# EAGLE design freeDSP (EAGLE 7.2.0)
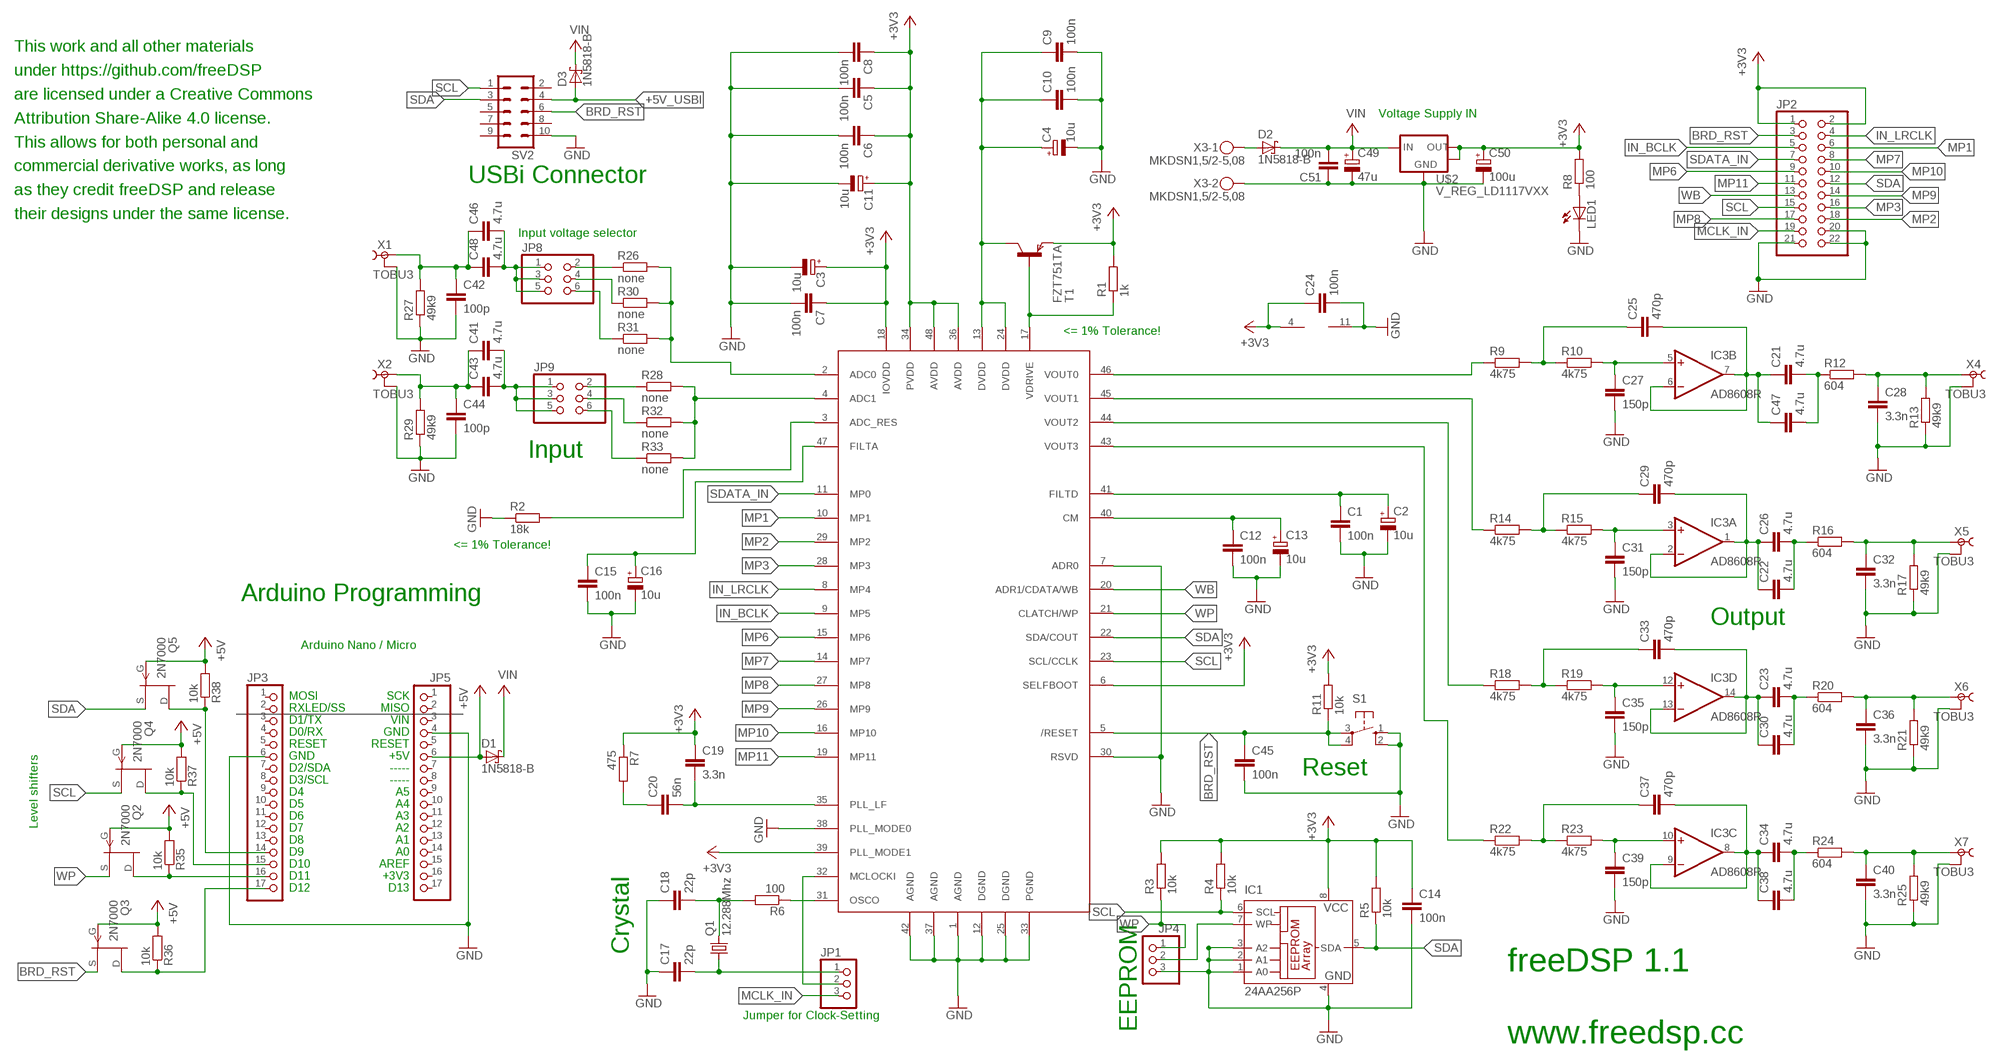
[diagram p0: schematic, sheet 1]

## Parts
C1  100n  C-EU025-025X050  [C025-025X050]
C2  10u  CPOL-EUE1.8-4  [E1,8-4]
C3  10u  CPOL-EUE1.8-4  [E1,8-4]
C4  10u  CPOL-EUE1.8-4  [E1,8-4]
C5  100n  C-EU025-025X050  [C025-025X050]
C6  100n  C-EU025-025X050  [C025-025X050]
C7  100n  C-EU025-025X050  [C025-025X050]
C8  100n  C-EU025-025X050  [C025-025X050]
C9  100n  C-EU025-025X050  [C025-025X050]
C10  100n  C-EU025-025X050  [C025-025X050]
C11  10u  CPOL-EUE1.8-4  [E1,8-4]
C12  100n  C-EU025-025X050  [C025-025X050]
C13  10u  CPOL-EUE1.8-4  [E1,8-4]
C14  100n  C-EU025-025X050  [C025-025X050]
C15  100n  C-EU025-025X050  [C025-025X050]
C16  10u  CPOL-EUE1.8-4  [E1,8-4]
C17  22p  C-EU025-025X050  [C025-025X050]
C18  22p  C-EU025-025X050  [C025-025X050]
C19  3.3n  C-EU025-025X050  [C025-025X050]
C20  56n  C-EU025-025X050  [C025-025X050]
C21  4.7u  C-EU050-075X075  [C050-075X075]
C22  4.7u  C-EU050-075X075  [C050-075X075]
C23  4.7u  C-EU050-075X075  [C050-075X075]
C24  100n  C-EU025-025X050  [C025-025X050]
C25  470p  C-EU050-050X075  [C050-050X075]
C26  4.7u  C-EU050-075X075  [C050-075X075]
C27  150p  C-EU025-025X050  [C025-025X050]
C28  3.3n  C-EU025-025X050  [C025-025X050]
C29  470p  C-EU050-050X075  [C050-050X075]
C30  4.7u  C-EU050-075X075  [C050-075X075]
C31  150p  C-EU025-025X050  [C025-025X050]
C32  3.3n  C-EU025-025X050  [C025-025X050]
C33  470p  C-EU050-050X075  [C050-050X075]
C34  4.7u  C-EU050-075X075  [C050-075X075]
C35  150p  C-EU025-025X050  [C025-025X050]
C36  3.3n  C-EU025-025X050  [C025-025X050]
C37  470p  C-EU050-050X075  [C050-050X075]
C38  4.7u  C-EU050-075X075  [C050-075X075]
C39  150p  C-EU025-025X050  [C025-025X050]
C40  3.3n  C-EU025-025X050  [C025-025X050]
C41  4.7u  C-EU050-075X075  [C050-075X075]
C42  100p  C-EU025-025X050  [C025-025X050]
C43  4.7u  C-EU050-075X075  [C050-075X075]
C44  100p  C-EU025-025X050  [C025-025X050]
C45  100n  C-EU025-025X050  [C025-025X050]
C46  4.7u  C-EU050-075X075  [C050-075X075]
C47  4.7u  C-EU050-075X075  [C050-075X075]
C48  4.7u  C-EU050-075X075  [C050-075X075]
C49  47u  CPOL-EUE2.5-6  [E2,5-6]
C50  100u  CPOL-EUE2.5-6  [E2,5-6]
C51  100n  C-EU025-025X050  [C025-025X050]
D1  1N5818-B  [DO41-7.6]
D2  1N5818-B  [DO41-7.6]
D3  1N5818-B  [DO41-7.6]
IC1  24AA256P  [DIL8]
IC3  AD8608R  [SO-14]
JP1  PINHD-1X3  [1X03]
JP2  PINHD-2X11  [2X11]
JP3  PINHD-1X17  [1X17]
JP4  PINHD-1X3  [1X03]
JP5  PINHD-1X17  [1X17]
JP8  PINHD-2X3  [2X03]
JP9  PINHD-2X3  [2X03]
LED1  LED3MM  [LED3MM]
Q1  12.288Mhz  CRYSTALHC49S  [HC49/S]
Q2  2N7000  2N3819  [TO92]
Q3  2N7000  2N3819  [TO92]
Q4  2N7000  2N3819  [TO92]
Q5  2N7000  2N3819  [TO92]
R1  1k  R-EU_0207/10  [0207/10]
R2  18k  R-EU_0207/10  [0207/10]
R3  10k  R-EU_0207/10  [0207/10]
R4  10k  R-EU_0207/10  [0207/10]
R5  10k  R-EU_0207/10  [0207/10]
R6  100  R-EU_0207/10  [0207/10]
R7  475  R-EU_0207/10  [0207/10]
R8  100  R-EU_0207/10  [0207/10]
R9  4k75  R-EU_0207/10  [0207/10]
R10  4k75  R-EU_0207/10  [0207/10]
R11  10k  R-EU_0207/10  [0207/10]
R12  604  R-EU_0207/10  [0207/10]
R13  49k9  R-EU_0207/10  [0207/10]
R14  4k75  R-EU_0207/10  [0207/10]
R15  4k75  R-EU_0207/10  [0207/10]
R16  604  R-EU_0207/10  [0207/10]
R17  49k9  R-EU_0207/10  [0207/10]
R18  4k75  R-EU_0207/10  [0207/10]
R19  4k75  R-EU_0207/10  [0207/10]
R20  604  R-EU_0207/10  [0207/10]
R21  49k9  R-EU_0207/10  [0207/10]
R22  4k75  R-EU_0207/10  [0207/10]
R23  4k75  R-EU_0207/10  [0207/10]
R24  604  R-EU_0207/10  [0207/10]
R25  49k9  R-EU_0207/10  [0207/10]
R26  none  R-EU_0207/10  [0207/10]
R27  49k9  R-EU_0207/10  [0207/10]
R28  none  R-EU_0207/10  [0207/10]
R29  49k9  R-EU_0207/10  [0207/10]
R30  none  R-EU_0207/10  [0207/10]
R31  none  R-EU_0207/10  [0207/10]
R32  none  R-EU_0207/10  [0207/10]
R33  none  R-EU_0207/10  [0207/10]
R35  10k  R-EU_0207/10  [0207/10]
R36  10k  R-EU_0207/10  [0207/10]
R37  10k  R-EU_0207/10  [0207/10]
R38  10k  R-EU_0207/10  [0207/10]
S1  10-XX  [B3F-10XX]
SV2  ML10  [ML10]
T1  FZT751TA  FZT789A  [SOT223]
U$1  ADAU1701  [LQFP-48]
U$2  V_REG_LD1117VXX  [78XXL]
X1  TOBU3  [TOBU3]
X2  TOBU3  [TOBU3]
X3  MKDSN1,5/2-5,08  [MKDSN1,5/2-5,08]
X4  TOBU3  [TOBU3]
X5  TOBU3  [TOBU3]
X6  TOBU3  [TOBU3]
X7  TOBU3  [TOBU3]

## Nets
1V8: C4.+ C9.1 C10.1 T1.2(C) T1.4(C) U$1.13(DVDD) U$1.24(DVDD)
+3V3: C3.+ C5.1 C6.1 C7.1 C8.1 C11.+ C14.1 C19.1 C24.1 C50.+ IC1.8(VCC) IC3.4(V+) JP2.1 JP2.2 R1.2 R3.2 R4.2 R5.2 R7.1 R8.2 R11.2 T1.3(E) U$1.6(SELFBOOT) U$1.18(IOVDD) U$1.34(PVDD) U$1.36(AVDD) U$1.39(PLL_MODE1) U$1.48(AVDD) U$2.GND(OUT) U$2.OUT2
+5V: D1.A JP5.6 Q2.2(G) Q3.2(G) Q4.2(G) Q5.2(G) R35.2 R36.2 R37.2 R38.2
+5V_USBI: D3.A SV2.4
ADC0: R28.2 R32.2 R33.2 U$1.4(ADC1)
BRD_RST: C45.1 JP2.3 Q3.3(S) R11.1 S1.3(P) S1.4(P1) SV2.6 U$1.5(/RESET)
CM: C12.1 C13.+ U$1.40(CM)
FILTA: C15.1 C16.+ U$1.47(FILTA)
FILTD: C1.1 C2.+ U$1.41(FILTD)
FILTOUT0: C28.1 R12.2 R13.2 X4.1
FILTOUT1: C32.1 R16.2 R17.2 X5.1
FILTOUT2: C36.1 R20.2 R21.2 X6.1
FILTOUT3: C40.1 R24.2 R25.2 X7.1
GND: C1.2 C2.- C3.- C4.- C5.2 C6.2 C7.2 C8.2 C9.2 C10.2 C11.- C12.2 C13.- C14.2 C15.2 C16.- C17.1 C18.1 C24.2 C27.2 C28.2 C31.2 C32.2 C35.2 C36.2 C39.2 C40.2 C42.2 C44.2 C45.2 C49.- C50.- C51.1 IC1.1(A0) IC1.2(A1) IC1.3(A2) IC1.4(GND) IC3.11(V-) JP2.20 JP2.21 JP2.22 JP3.6 JP4.3 JP5.4 LED1.K(C) R2.1 R13.1 R17.1 R21.1 R25.1 R27.1 R29.1 S1.1(S) S1.2(S1) SV2.10 U$1.1(AGND) U$1.7(ADR0) U$1.12(DGND) U$1.25(DGND) U$1.30(RSVD) U$1.33(PGND) U$1.37(AGND) U$1.38(PLL_MODE0) U$1.42(AGND) U$2.IN(GND) X1.2 X1.2@1 X1.2@2 X2.2 X2.2@1 X2.2@2 X3.2 X4.2 X4.2@1 X4.2@2 X5.2 X5.2@1 X5.2@2 X6.2 X6.2@1 X6.2@2 X7.2 X7.2@1 X7.2@2
IN_BCLK: JP2.5 U$1.9(MP5)
IN_LRCLK: JP2.4 U$1.8(MP4)
MCLK_IN: JP1.3 JP2.19
MP1: JP2.6 U$1.10(MP1)
MP2: JP2.18 U$1.29(MP2)
MP3: JP2.16 U$1.28(MP3)
MP6: JP2.9 U$1.15(MP6)
MP7: JP2.8 U$1.14(MP7)
MP8: JP2.17 U$1.27(MP8)
MP9: JP2.14 U$1.26(MP9)
MP10: JP2.10 U$1.16(MP10)
MP11: JP2.11 U$1.19(MP11)
N$1: R2.2 U$1.3(ADC_RES)
N$2: R1.1 T1.1(B) U$1.17(VDRIVE)
N$3: C19.2 C20.2 U$1.35(PLL_LF)
N$4: C23.1 C30.1 C33.2 IC3.13(D:-IN) IC3.14(D:OUT)
N$5: C20.1 R7.2
N$6: C18.2 Q1.2 R6.2
N$7: C17.2 JP1.1 Q1.1
N$8: R6.1 U$1.31(OSCO)
N$9: LED1.A R8.1
N$10: JP1.2 U$1.32(MCLOCKI)
N$11: JP3.15 Q4.1(D) R37.1
N$12: C21.2 C47.2 R12.1
N$13: C29.1 R14.2 R15.1
N$14: JP3.14 Q5.1(D) R38.1
N$15: C22.1 C26.1 C29.2 IC3.1(A:OUT) IC3.2(A:-IN)
N$16: C31.1 IC3.3(A:+IN) R15.2
N$17: C25.1 R9.2 R10.1
N$18: C21.1 C25.2 C47.1 IC3.6(B:-IN) IC3.7(B:OUT)
N$19: C22.2 C26.2 R16.1
N$20: C27.1 IC3.5(B:+IN) R10.2
N$21: C33.1 R18.2 R19.1
N$22: C23.2 C30.2 R20.1
N$23: JP3.16 Q2.1(D) R35.1
N$24: C35.1 IC3.12(D:+IN) R19.2
N$25: JP3.17 Q3.1(D) R36.1
N$26: C37.1 R22.2 R23.1
N$27: C34.1 C37.2 C38.1 IC3.8(C:OUT) IC3.9(C:-IN)
N$28: C39.1 IC3.10(C:+IN) R23.2
N$29: C34.2 C38.2 R24.1
N$30: C46.2 C48.2 JP8.1 JP8.3 JP8.5
N$31: C42.1 C46.1 C48.1 R27.2 X1.1
N$32: JP8.2 R26.1
N$33: JP8.4 R30.1
N$34: C41.1 C43.1 C44.1 R29.2 X2.1
N$35: JP8.6 R31.1
N$36: C41.2 C43.2 JP9.1 JP9.3 JP9.5
N$37: JP9.2 R28.1
N$38: JP9.4 R32.1
N$39: JP9.6 R33.1
N$40: R26.2 R30.2 R31.2 U$1.2(ADC0)
N$41: D2.A X3.1
N$43: IC1.7(WP) JP4.2
SCL: IC1.6(SCL) JP2.15 Q4.3(S) R4.1 SV2.1 U$1.23(SCL/CCLK)
SDA: IC1.5(SDA) JP2.12 Q5.3(S) R5.1 SV2.3 U$1.22(SDA/COUT)
SDATA_IN: JP2.7 U$1.11(MP0)
V+: C49.+ C51.2 D1.C D2.C D3.C U$2.OUT(IN) ; supply symbol labelled VIN
VOUT0: R9.1 U$1.46(VOUT0)
VOUT1: R14.1 U$1.45(VOUT1)
VOUT2: R18.1 U$1.44(VOUT2)
VOUT3: R22.1 U$1.43(VOUT3)
WB: JP2.13 U$1.20(ADR1/CDATA/WB)
WP: JP4.1 Q2.3(S) R3.1 U$1.21(CLATCH/WP)
Unconnected: JP3.1 JP3.2 JP3.3 JP3.4 JP3.5 JP3.7 JP3.8 JP3.9 JP3.10 JP3.11 JP3.12 JP3.13 JP5.1 JP5.2 JP5.3 JP5.5 JP5.7 JP5.8 JP5.9 JP5.10 JP5.11 JP5.12 JP5.13 JP5.14 JP5.15 JP5.16 JP5.17 SV2.2 SV2.5 SV2.7 SV2.8 SV2.9

## Notes on the sheet
- Voltage Supply IN
- USBi Connector
- This work and all other materials 
  under https://github.com/freeDSP 
  are licensed under a Creative Commons 
  Attribution Share-Alike 4.0 license. 
  This allows for both personal and 
  commercial derivative works, as long 
  as they credit freeDSP and release 
  their designs under the same license.
- Input voltage selector
- <= 1% Tolerance!
- Input
- <= 1% Tolerance!
- Arduino Programming
- Output
- Arduino Nano / Micro
- Reset
- Level shifters
- Crystal
- MOSI
  RXLED/SS
  D1/TX
  D0/RX
  RESET
  GND
  D2/SDA
  D3/SCL
  D4
  D5
  D6
  D7
  D8
  D9
  D10
  D11
  D12
- SCK
  MISO
  VIN
  GND
  RESET
  +5V
  -----
  -----
  A5
  A4
  A3
  A2
  A1
  A0
  AREF
  +3V3
  D13
- Jumper for Clock-Setting
- EEPROM
- freeDSP 1.1
  
  www.freedsp.cc

## Library data of the parts
C1 C5-C10 C12 C14 C15 C17-C48 C51 = rcl:C-EU: CAPACITOR, European symbol
C2-C4 C11 C13 C16 C49 C50 = rcl:CPOL-EU: POLARIZED CAPACITOR, European symbol
D1-D3 = diode:1N581*: 1.0A SCHOTTKY BARRIER RECTIFIER Source: http://www.diodes.com/datasheets/ds23001.pdf
IC1 = microchip:24*: Serial EEPROM I2C; MF: MICROCHIP; MPN: 24AA256-I/P; OC_FARNELL: 1331294; OC_NEWARK: 92C6872
IC3 = 0-ADI-variety:AD8608*
JP1 JP4 = pinhead:PINHD-1X3: PIN HEADER
JP2 = pinhead:PINHD-2X11: PIN HEADER
JP3 JP5 = pinhead:PINHD-1X17: PIN HEADER
JP8 JP9 = pinhead:PINHD-2X3: PIN HEADER
LED1 = led:LED: LED OSRAM: - CHIPLED LG R971, LG N971, LY N971, LG Q971, LY Q971, LO R971, LY R971 LH N974, LH R974 LS Q976, LO Q976, LY Q976 LO Q996 - Hyper CHIPLED LW Q18S LB Q993, LB Q99A, LB R99A - SideLED LS A670, LO A670, LY A670, LG A670, LP A670 LB A673, LV A673, LT A673, LW A673 LH A674 LY A675 LS A676, LA A676, LO A676, LY A676, LW A676 LS A679, LY A679, LG A679 - Hyper Micro SIDELED® LS Y876, LA Y876, LO Y876, LY Y876 LT Y87S - SmartLED LW L88C, LW L88S LB L89C, LB L89S, LG L890 LS L89K, LO L89K, LY L89K LS L896, LA L896, LO L896, LY L896 - TOPLED LS T670, LO T670, LY T670, LG T670, LP T670 LSG T670, LSP T670, LSY T670, LOP T670, LYG T670 LG T671, LOG T671, LSG T671 LB T673, LV T673, LT T673, LW T673 LH T674 LS T676, LA T676, LO T676, LY T676, LB T676, LH T676, LSB T676, LW T676 LB T67C, LV T67C, LT T67C, LS T67K, LO T67K, LY T67K, LW E67C LS E67B, LA E67B, LO E67B, LY E67B, LB E67C, LV E67C, LT E67C LW T67C LS T679, LY T679, LG T679 LS T770, LO T770, LY T770, LG T770, LP T770 LB T773, LV T773, LT T773, LW T773 LH T774 LS E675, LA E675, LY E675, LS T675 LS T776, LA T776, LO T776, LY T776, LB T776 LHGB T686 LT T68C, LB T68C - Hyper Mini TOPLED® LB M676 - Mini TOPLED Santana® LG M470 LS M47K, LO M47K, LY M47K Source: http://www.osram.convergy.de LUXEON: - LUMILED® LXK2-PW12-R00, LXK2-PW12-S00, LXK2-PW14-U00, LXK2-PW14-V00 LXK2-PM12-R00, LXK2-PM12-S00, LXK2-PM14-U00 LXK2-PE12-Q00, LXK2-PE12-R00, LXK2-PE12-S00, LXK2-PE14-T00, LXK2-PE14-U00 LXK2-PB12-K00, LXK2-PB12-L00, LXK2-PB12-M00, LXK2-PB14-N00, LXK2-PB14-P00, LXK2-PB14-Q00 LXK2-PR12-L00, LXK2-PR12-M00, LXK2-PR14-Q00, LXK2-PR14-R00 LXK2-PD12-Q00, LXK2-PD12-R00, LXK2-PD12-S00 LXK2-PH12-R00, LXK2-PH12-S00 LXK2-PL12-P00, LXK2-PL12-Q00, LXK2-PL12-R00 Source: www.luxeon.com KINGBRIGHT: KA-3528ASYC Source: www.kingbright.com
Q1 = crystal:CRYSTAL: CRYSTAL; OC_FARNELL: 1667008; OC_NEWARK: unknown
Q2-Q5 = transistor-fet:2N3819: N-Channel Junction FET
R1-R33 R35-R38 = rcl:R-EU_: RESISTOR, European symbol
S1 = switch-omron:10-XX: OMRON SWITCH; MPN: B3F-1000; OC_FARNELL: 176432; OC_NEWARK: 36M3542
SV2 = con-harting-ml:ML10: HARTING; OC_FARNELL: unknown; OC_NEWARK: unknown
T1 = zetex:FZT789A: PNP TRANSISTOR; MPN: FZT789A; OC_FARNELL: 9526633; OC_NEWARK: 97K0407
U$1 = analog-devices_2:ADAU1701
U$2 = SparkFun-PowerIC:V_REG_LD1117VXX: LD1117VXX voltage regulator. We carry the 3.3V version (COM-00526) in TO-220 package.
X1 X2 X4-X7 = con-hirschmann_verbessert:TOBU3: Female Cinch CONNECTOR ( RCA Jack ); MF: FARNELL; MPN: TOBU 3; OC_FARNELL: 592791; OC_NEWARK: 06WX5914
X3 = con-phoenix-508:MKDSN1,5/2-5,08: MKDSN 1,5/ 2-5,08 Printklemme Nennstrom: 13,5 A Nennspannung: 250 V Rastermaß: 5,08 mm Polzahl: 2 Anschlussart: Schraubanschluss Montage: Löten Anschlussrichtung Leiter/Platine: 0 ° Artikelnummer: 1729128 Source: http://eshop.phoenixcontact.com .. 1729128.pdf; MPN: MKDSN 1,5/2-5.08; OC_FARNELL: 1792903; OC_NEWARK: 30M2397

## Net classes
0 default: width 0.152 mm

## Board
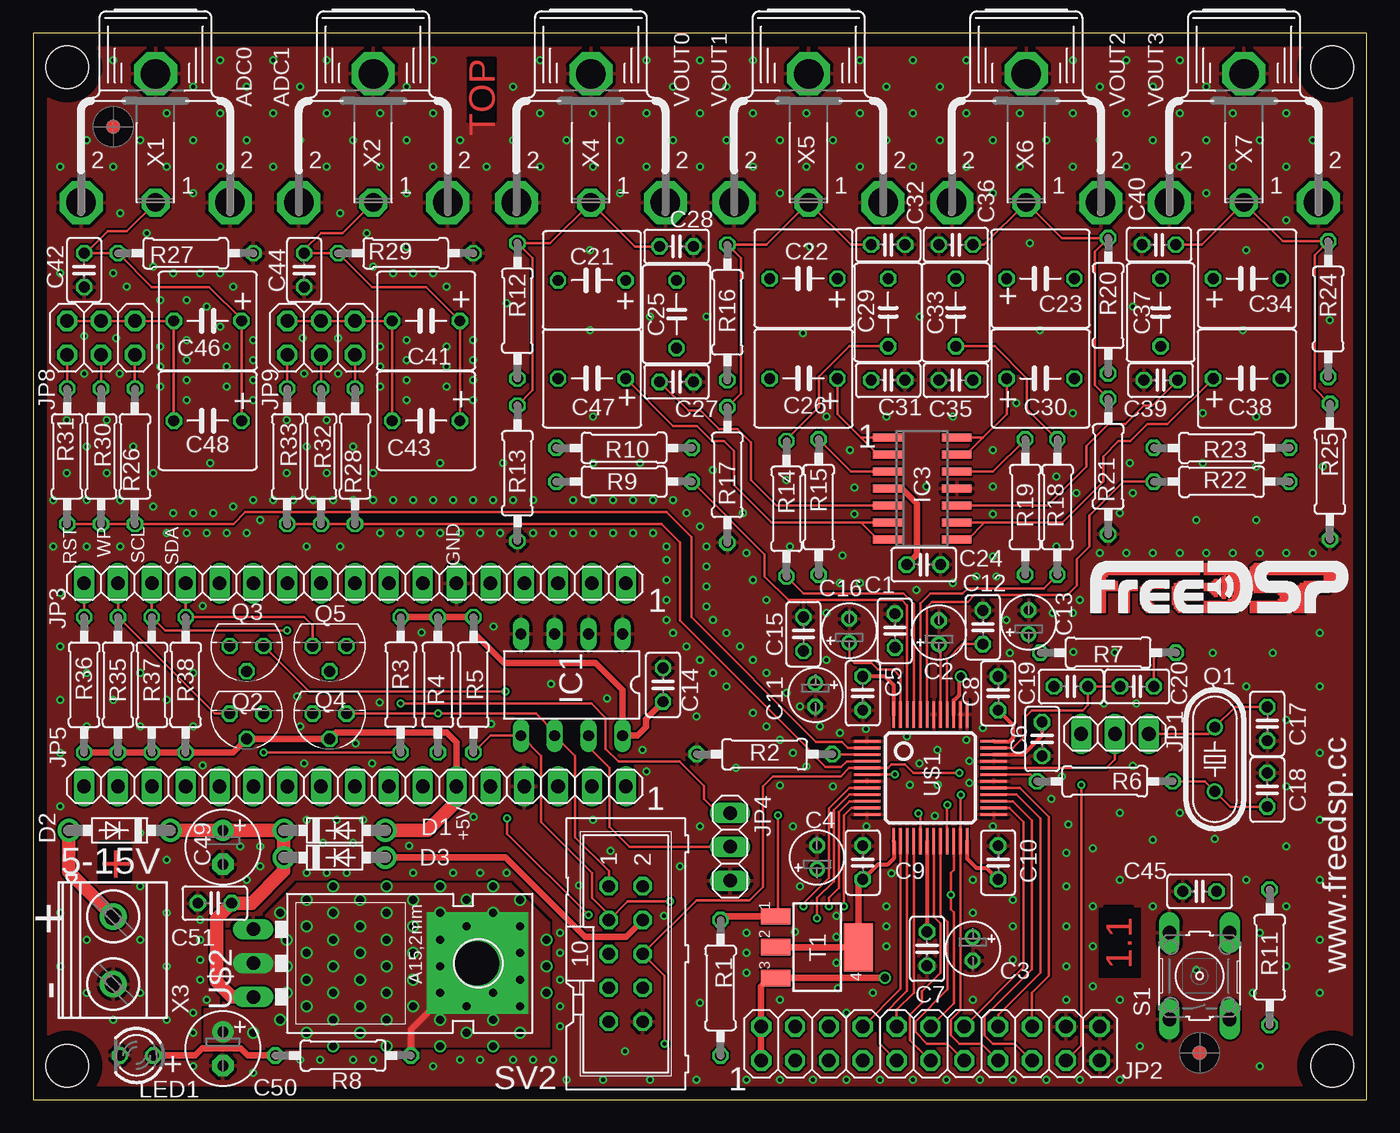
[diagram p1: board, top side]
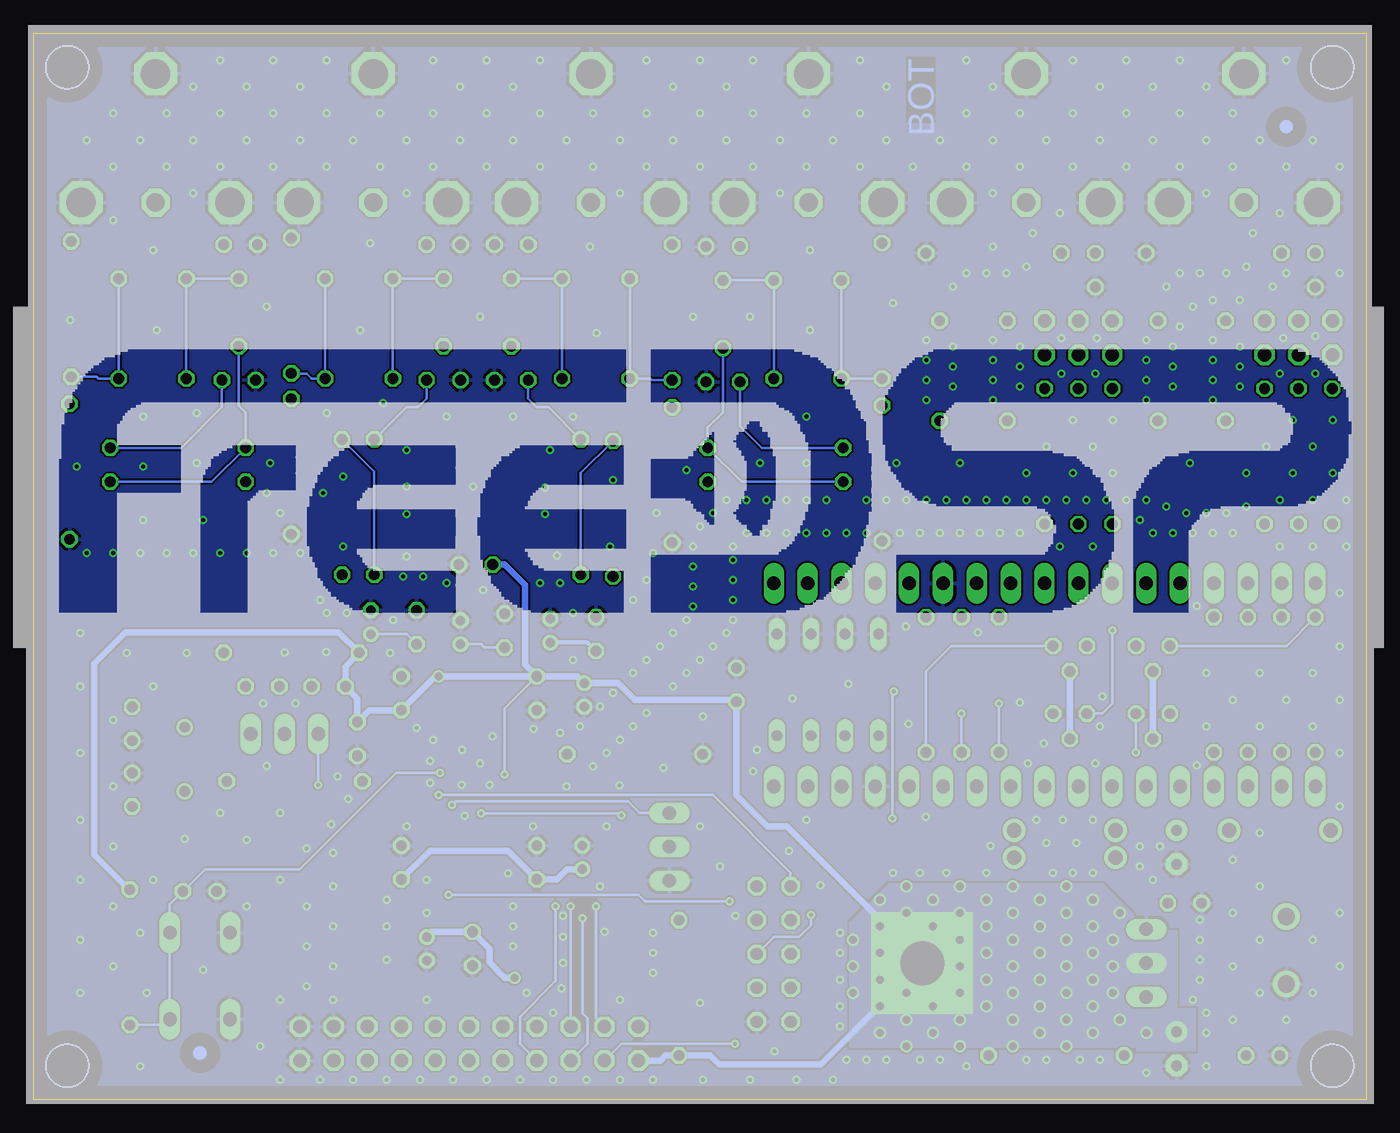
[diagram p2: board, bottom side, seen from below]

Size 100 x 80 mm. Coordinates in mm from the lower left corner, seen from the top.
Outline: 0,0 100,0 100,80 0,80 0,0
Copper layers (1*16): Top 0.035mm / dielectric 1.5mm / Bottom 0.035mm
Design rules "default *": minimum track width 0.15mm, minimum drill 0.3mm, track to track 0.15mm, track to pad 0.15mm, pad to pad 0.15mm, via to via 0.15mm, smd to smd 0mil, copper to edge 40mil, drill to drill 8mil, minimum pad ring 0.15mm, minimum via ring 0.15mm, stop-mask expansion 4mil, vias tented up to drill 0.3mm, thermal gap 10mil
Holes 3.2 mm at 97.46,77.46 2.54,77.46 97.46,2.54 2.54,2.54
tRestrict: area 80,9.2 to 83.1,14.4

### Footprints (pad centres in the part's own frame; a part is rotated, then mirrored left to right if it is on the bottom)
C025-025X050 = drill 0.813 octagon: 1 -1.27,0; 2 1.27,0
E1,8-4 = drill 0.711 pad 1.168: + -0.889,0 | drill 0.711 pad 1.168 octagon: - 0.889,0
C050-075X075 = drill 0.813 octagon: 1 -2.54,0; 2 2.54,0
C050-050X075 = drill 0.813 octagon: 1 -2.54,0; 2 2.54,0
E2,5-6 = drill 0.813 pad 1.6: + -1.27,0 | drill 0.813 pad 1.6 octagon: - 1.27,0
DO41-7.6 = drill 1.1 pad 1.7: A 3.81,0; C -3.81,0
DIL8 = drill 0.813 long: 1 -3.81,-3.81; 2 -1.27,-3.81; 3 1.27,-3.81; 4 3.81,-3.81; 5 3.81,3.81; 6 1.27,3.81; 7 -1.27,3.81; 8 -3.81,3.81
SO-14 = smd 0.6 x 2.2: 1 -3.81,-2.6; 2 -2.54,-2.6; 3 -1.27,-2.6; 4 0,-2.6; 5 1.27,-2.6; 6 2.54,-2.6; 7 3.81,-2.6; 8 3.81,2.6; 9 2.54,2.6; 10 1.27,2.6; 11 0,2.6; 12 -1.27,2.6; 13 -2.54,2.6; 14 -3.81,2.6
1X03 = drill 1.016 long: 1 -2.54,0; 2 0,0; 3 2.54,0
2X11 = drill 1.016 octagon: 1 -12.7,-1.27; 2 -12.7,1.27; 3 -10.16,-1.27; 4 -10.16,1.27; 5 -7.62,-1.27; 6 -7.62,1.27; 7 -5.08,-1.27; 8 -5.08,1.27; 9 -2.54,-1.27; 10 -2.54,1.27; 11 0,-1.27; 12 0,1.27; 13 2.54,-1.27; 14 2.54,1.27; 15 5.08,-1.27; 16 5.08,1.27; 17 7.62,-1.27; 18 7.62,1.27; 19 10.16,-1.27; 20 10.16,1.27; 21 12.7,-1.27; 22 12.7,1.27
1X17 = drill 1.016 long: 1 -20.32,0; 2 -17.78,0; 3 -15.24,0; 4 -12.7,0; 5 -10.16,0; 6 -7.62,0; 7 -5.08,0; 8 -2.54,0; 9 0,0; 10 2.54,0; 11 5.08,0; 12 7.62,0; 13 10.16,0; 14 12.7,0; 15 15.24,0; 16 17.78,0; 17 20.32,0
2X03 = drill 1.016 octagon: 1 -2.54,-1.27; 2 -2.54,1.27; 3 0,-1.27; 4 0,1.27; 5 2.54,-1.27; 6 2.54,1.27
LED3MM = drill 0.813 octagon: A -1.27,0; K 1.27,0
HC49/S = drill 0.813: 1 -2.413,0; 2 2.413,0
TO92 = drill 0.813 octagon: 1 1.27,0; 2 0,1.905; 3 -1.27,0
0207/10 = drill 0.813 octagon: 1 -5.08,0; 2 5.08,0
B3F-10XX = drill 1.016 long: 1 -3.251,2.261; 2 3.251,2.261; 3 -3.251,-2.261; 4 3.251,-2.261
ML10 = drill 0.914 octagon: 1 -5.08,-1.27; 2 -5.08,1.27; 3 -2.54,-1.27; 4 -2.54,1.27; 5 0,-1.27; 6 0,1.27; 7 2.54,-1.27; 8 2.54,1.27; 9 5.08,-1.27; 10 5.08,1.27
SOT223 = smd 1.219 x 2.235: 1 -2.311,-3.099; 2 0,-3.099; 3 2.311,-3.099 | smd 3.6 x 2.2: 4 0,3.099
LQFP-48 = smd 0.2 x 2: 1 -2.75,-4.75; 2 -2.25,-4.75; 3 -1.75,-4.75; 4 -1.25,-4.75; 5 -0.75,-4.75; 6 -0.25,-4.75; 7 0.25,-4.75; 8 0.75,-4.75; 9 1.25,-4.75; 10 1.75,-4.75; 11 2.25,-4.75; 12 2.75,-4.75; 25 2.75,4.75; 26 2.25,4.75; 27 1.75,4.75; 28 1.25,4.75; 29 0.75,4.75; 30 0.25,4.75; 31 -0.25,4.75; 32 -0.75,4.75; 33 -1.25,4.75; 34 -1.75,4.75; 35 -2.25,4.75; 36 -2.75,4.75 | smd 2 x 0.2: 13 4.75,-2.75; 14 4.75,-2.25; 15 4.75,-1.75; 16 4.75,-1.25; 17 4.75,-0.75; 18 4.75,-0.25; 19 4.75,0.25; 20 4.75,0.75; 21 4.75,1.25; 22 4.75,1.75; 23 4.75,2.25; 24 4.75,2.75; 37 -4.75,2.75; 38 -4.75,2.25; 39 -4.75,1.75; 40 -4.75,1.25; 41 -4.75,0.75; 42 -4.75,0.25; 43 -4.75,-0.25; 44 -4.75,-0.75; 45 -4.75,-1.25; 46 -4.75,-1.75; 47 -4.75,-2.25; 48 -4.75,-2.75
78XXL = drill 1.016 long: GND 0,-3.81; IN -2.54,-3.81; OUT 2.54,-3.81 | drill 3.302 pad 7.62 square: OUT2 0,13
TOBU3 = drill 1.397 octagon: 1 0,-2.54 | drill 2.21 octagon: 2 5.588,-2.54; 2@1 -5.588,-2.54; 2@2 0,7.11
MKDSN1,5/2-5,08 = drill 1.3 pad 2: 1 -2.561,0.025; 2 2.519,0.025

### Placement (x,y rotation side)
C1  64.64,35.18 90 top
C2  67.94,35.05 90 top
C3  70.48,11.3 270 top
C4  58.8,18.16 90 top
C5  62.23,30.48 270 top
C6  75.69,27.05 270 top
C7  67.06,11.3 270 top
C8  72.39,30.48 90 top
C9  62.23,17.78 90 top
C10  72.39,17.78 90 top
C11  58.67,30.35 270 top
C12  71.25,35.43 90 top
C13  74.68,35.81 90 top
C14  47.24,31.11 90 top
C15  57.78,34.92 90 top
C16  61.21,35.18 90 top
C17  92.58,28.19 90 top
C18  92.58,23.24 270 top
C19  77.85,30.99 0 top
C20  82.8,30.99 180 top
C21  41.91,61.47 180 top
C22  57.78,61.59 180 top
C23  75.56,61.59 0 top
C24  66.8,40.13 0 top
C25  48.26,58.93 90 top
C26  57.78,54.1 180 top
C27  48.26,53.85 0 top
C28  48.26,64.01 0 top
C29  64.14,59.05 90 top
C30  75.56,54.1 0 top
C31  64.14,53.98 0 top
C32  64.14,64.14 0 top
C33  69.22,59.05 90 top
C34  91.06,61.59 0 top
C35  69.22,53.98 180 top
C36  69.22,64.14 180 top
C37  84.58,59.05 90 top
C38  91.06,54.1 0 top
C39  84.58,53.98 180 top
C40  84.45,64.14 180 top
C41  29.46,58.42 180 top
C42  3.81,62.23 270 top
C43  29.46,50.93 180 top
C44  20.32,62.23 270 top
C45  87.5,15.62 180 top
C46  13.08,58.42 180 top
C47  41.91,54.1 180 top
C48  13.08,50.93 180 top
C49  14.22,18.92 270 top
C50  14.22,3.81 270 top
C51  13.62,14.74 0 top
D1  22.61,20.19 0 top
D2  6.48,20.19 180 top
D3  22.61,18.16 0 top
IC1  40.39,31.11 180 top
IC3  66.67,45.85 270 top
JP1  81.15,27.43 180 top
JP2  67.31,4.19 0 top
JP3  24.13,38.73 180 top
JP4  52.27,18.96 270 top
JP5  24.13,23.5 180 top
JP8  5.08,57.15 180 top
JP9  21.59,57.15 180 top
LED1  7.75,3.3 180 top
Q1  88.65,25.53 270 top
Q2  16,28.96 180 top
Q3  16,34.04 180 top
Q4  22.23,28.96 180 top
Q5  22.23,34.04 180 top
R1  51.56,8.38 270 top
R2  54.86,25.91 0 top
R3  27.56,31.11 90 top
R4  30.35,31.11 90 top
R5  33.02,31.11 90 top
R6  80.39,23.88 0 top
R7  80.64,33.53 0 top
R8  23.24,3.3 0 top
R9  44.32,46.35 180 top
R10  44.32,48.9 180 top
R11  92.76,10.67 90 top
R12  36.32,59.18 90 top
R13  36.32,46.99 90 top
R14  56.52,44.32 90 top
R15  58.93,44.45 90 top
R16  52.07,59.05 90 top
R17  52.07,46.86 90 top
R18  76.83,44.45 90 top
R19  74.42,44.45 90 top
R20  80.64,59.56 90 top
R21  80.64,47.5 90 top
R22  89.15,46.35 0 top
R23  89.15,48.9 0 top
R24  97.16,59.31 90 top
R25  97.28,47.12 90 top
R26  7.62,48.26 270 top
R27  11.43,63.5 180 top
R28  24.13,48.26 270 top
R29  27.94,63.5 180 top
R30  5.08,48.26 270 top
R31  2.54,48.26 270 top
R32  21.59,48.26 270 top
R33  19.05,48.26 270 top
R35  6.35,31.11 270 top
R36  3.81,31.11 270 top
R37  8.89,31.11 270 top
R38  11.43,31.11 270 top
S1  87.5,9.27 90 top
SV2  44.45,10.92 270 top
T1  58.8,11.43 270 top
U$1  67.31,24.13 270 top
U$2  20.31,10.23 270 top
U$3  [VISION_REF10]  87.5,3.5 0 top
U$4  [VISION_REF10]  6,73 0 top
X1  9.17,69.85 0 top
X2  25.5,69.85 0 top
X3  5.97,11.18 270 top
X4  41.83,69.85 0 top
X5  58.17,69.85 0 top
X6  74.5,69.85 0 top
X7  90.83,69.85 0 top

### Tracks (layer width: path | path; a pad name or v marks a point on that pad's centre or on a via)
1V8
  Top 0.3: U$1.24 70.06,18.08 70.74,17.4 71.5,17.4 C10.1 | C9.1 63.37,17.65 64.14,17.65 64.56,18.08 U$1.13
  Top 0.5: C9.1 61.9,16.18 T1.4 T1.2
  Bottom 0.5: C10.1 70.23,18.67 64.39,18.67 C9.1 60.71,16.51 59.94,17.27 C4.+
+3V3  (via drill 0.3, 0.6)
  Top 0.2: U$1.6 v64.64,24.38
  Top 0.3: U$1.18 67.06,17.02 | 67.06,17.02 | U$1.34 74.27,25.88 75.69,27.3 C6.1 | U$1.39 69.06,29.94 69.47,30.35 69.47,31.62 v69.6,31.75 | U$1.36 73.23,26.88 73.53,27.18 73.53,28.07 C8.1 | U$1.48 64.56,31.07 63.88,31.75 C5.1 | 67.06,17.02 C7.1
  Top 0.5: R3.2 R4.2 R5.2 33.02,35.05 35.31,32.77 42.16,32.77 44.2,30.73 IC1.8 45.34,27.3 45.97,27.94 45.97,28.57 C14.1 | C24.1 66.29,40.89 66.29,44.7 65.15,45.85 IC3.4 | JP2.1 JP2.2 54.61,8.51 55.22,9.12 T1.3 63.86,9.12 v63.88,9.14 | R8.2 28.35,3.33 28.35,5.28 U$2.OUT2
  Bottom 0.2: v64.64,24.38 64.64,29.34 C5.1
  Bottom 0.5: C5.1 59.18,31.75 C11.+ 56.13,31.24 54.86,29.97 47.37,29.97 C14.1 47.24,22.81 44.91,20.48 43.44,20.48 33.31,10.35 U$2.OUT2 40.9,2.64 48.56,2.64 49.22,3.3 R1.2 52.58,3.3 52.96,2.92 JP2.1 | C5.1 63.12,32.64 63.12,38.61 64.64,40.13 C24.1 | C5.1 v69.6,31.75 69.85,31.75 C8.1 74.8,29.21 C6.1 75.69,30.1 C19.1 76.58,32.51 R7.1 77.09,35.05 93.09,35.05 95.42,32.72 95.42,18.35 92.82,15.75 R11.2 | C3.+ 70.1,12.57 C7.1 65.79,11.3 65.79,10.29 64.64,9.14 v63.88,9.14
  other vias: 20.5,15 20.5,13 20.5,11 20.5,9 20.5,7 20.5,5 22.5,14 22.5,12 22.5,10 22.5,8 22.5,6 24.5,5 26.5,6 24.5,7 24.5,9 24.5,11 24.5,13 24.5,15 26.5,14 26.5,12 26.5,10 26.5,8 28.5,15 28.5,13 28.5,11 28.5,9 28.5,7 30.5,14 30.5,12 30.5,10 30.5,6 32.5,15 32.5,13 32.5,7 32.5,5 34.5,6 34.5,14 30.5,8 34.5,8 36.5,13 36.5,11 36.5,9 36.5,7 36.5,5 38.5,8 38.5,10 38.5,12 36.5,15 18.5,14 18.5,6 19,12 19,10 19,8 16.5,5 22.5,16 26.5,16 30.5,16 34.5,16 30.5,4 34.5,4 26.5,4 22.5,4
  pour Top (no thermals): 16.27,12.66 14.26,12.66 14.26,6.78 12.86,6.78 12.86,3.59 17.33,3.59 17.33,3.98 38.7,3.98 38.7,13.3 35.81,16.19 19.81,16.19
  pour Bottom (no thermals): 16.27,12.62 14.26,12.62 14.26,6.75 12.86,6.75 12.86,3.71 17.18,3.71 17.18,3.95 38.7,3.95 38.7,13.26 35.81,16.16 19.81,16.16
+5V
  Top 0.5: JP5.6 31.75,26.8 30.99,27.56 22.73,27.56 Q4.2 Q2.2 14.99,26.04 R38.2 R37.2 R35.2 R36.2
  Top 1: JP5.6 31.75,22.35 29.59,20.19 D1.A
  Bottom 0.5: Q3.2 Q2.2 | Q4.2 Q5.2
+5V_USBI
  Top 0.5: SV2.4 44.45,12.19 41.4,12.19 35.43,18.16 D3.A
ADC0
  Top 0.2: R33.2 R32.2 R28.2 47.14,43.18 48.52,41.81 48.52,35.96 58.66,25.82 58.66,25.74 59.44,24.96 60.61,24.96 61.03,25.38 U$1.4
BRD_RST  (via drill 0.3)
  Top 0.2: v41.66,13.84 35.56,19.94 v35.56,21.08 | Q3.3 20.7,30.61 v35.43,30.61 | v69.47,24.51 66.04,24.51 65.41,25.15 64.39,25.15 64.12,24.88 U$1.5 61.2,24.88 60.58,24.26 55.5,24.26 54.74,23.5 54.74,15.95 53.73,14.94 49.74,14.94 SV2.6 47.37,9.27 v47.37,4.19
  Bottom 0.2: v41.66,13.84 41.66,13.08 42.55,12.19 44.45,12.19 SV2.6 | v35.43,30.61 35.56,30.48 v35.56,21.08 | v69.47,24.51 72.77,24.51 80.01,17.27 87.12,17.27 C45.1 89.76,14.63 S1.4 S1.3 90.19,5.59 R11.1 | JP2.3 55.88,4.19 v47.37,4.19
CM
  Top 0.2: U$1.40 68.56,33 69.72,34.16 C12.1
  Bottom 0.2: C12.1 72.01,34.92 C13.+
FILTA
  Top 0.2: U$1.47 65.06,31.71 64.52,32.26 63.37,32.26 62.87,32.77 61.59,32.77 61.21,33.15 C16.+
  Bottom 0.3: C15.1 58.42,34.29 C16.+
FILTD  (1 unrouted)
  Top 0.2: U$1.41 68.06,34.05 C2.+
  Bottom 0.2: C1.1 66.17,33.91 66.42,34.16 C2.+ | 68.06,34.05 68.06,34
FILTOUT0
  Top 0.2: C28.1 45.13,64.01 X4.1 38.78,64.26 R12.2 37.47,63.12 37.47,53.21 R13.2
FILTOUT1
  Top 0.2: C32.1 61.34,64.14 X5.1 54.99,64.14 R16.2 53.09,63.12 53.09,52.96 R17.2
FILTOUT2
  Top 0.2: C36.1 71.33,64.14 X6.1 77.17,64.64 R20.2 79.63,63.63 79.63,53.59 R21.2
FILTOUT3
  Top 0.2: R25.2 96.14,53.34 96.14,63.37 R24.2 93.75,64.39 X7.1 87.66,64.14 C40.1
GND  (via drill 0.3)
  other vias: 58,25 57,26 56,27 55,28 54,29 52,31 51,32 50,33 49,34 48,35 47.5,36 47.5,37.5 47.5,39 47.5,40.5 47.5,41.5 46.5,42.5 45,42.5 43.5,42.5 42,42.5 40.5,42.5 39,42.5 37.5,42.5 35,42.5 33.5,42.5 32,42.5 30.5,42.5 29,42.5 27.5,42.5 26,42.5 23,41.5 20.5,41.5 17,43.5 16,42.5 14.5,42.5 13,42.5 11.5,42.5 10,42.5 6.5,41.5 4,41.5 1.5,41.5 60.5,27.5 59,28 57.5,29.5 56.5,30.5 55,32 54,33 53,34 52,35 51,36 50.5,37 50.5,38.5 50.5,40 50.5,41.5 50,43 49,44 48,45 46.5,45 45,45 43.5,45 42,45 40.5,45 37.5,45 36,45 34.5,45 33,45 31.5,45 30,45 28.5,45 27,45 25.5,45 24,45 22.5,45 21,45 19.5,45 18,45 16.5,45 15,44.5 13.5,44 12,44 10.5,44 9,44.5 6.5,45 4,45 1.5,45 2.5,47 4,49 2.5,51 5.5,51 5.5,47 7.5,49 9,47 19,47 19,51 22,51 22,47 20.5,49 24,49 25.5,47 67,46 72,46 15.5,19 17,19 17,17.5 16,16.5 20.5,17 22,17 23.5,17 28.5,17 31.5,17 33.5,17 35.5,17 39.5,12.5 39.5,11 39.5,9 39.5,7 39.5,5.5 39,3 37.5,3 36,3 33.5,3 32,3 30,2.5 25.5,3 24,3 21.5,3 20,3 16.5,2 12,2.5 12,5 12,6.5 13,7.5 12.5,9 12.5,10.5 12.5,12 12.5,13.5 62.48,27.81 70,27 60,23.5 70.23,23.75 70.23,25.4 62.5,20.5 72,20.5 67.63,21.27 65.79,23.62 67.88,23.62 66.48,25.21 65.53,27.24 56.01,23.56 71.25,27.88 77.15,24.26 82.49,25.02 88.65,19.56 76.39,22.54 77.66,20.64 79.5,18.86 92,2.5 76,1.5 73.5,1.5 71,1.5 68.5,1.5 66,1.5 63.5,1.5 61,1.5 58.5,1.5 56,1.5 78.5,1.5 81.5,1.5 53.5,1.5 70.5,16.5 70.5,14 73.5,15 73.5,13 73.5,10.5 70.5,7.5 61,6.5 63,8 64,14.5 57.15,12.57 57.5,16 57,20.5 53.5,12.5 53.5,11 53.5,9.5 64,13 64,11.5 77.5,10 77.5,13 77.5,16 77.5,18.5 77.5,7.5 96.5,8 96.5,12 96.5,16.5 96.5,21 96.5,26 96.5,31 96.5,35 94,14.5 94,19 94,10 94,23.5 94,28.5 93,33.5 91,31 91,16.5 92,12.5 91.5,8 84,19.5 81.5,21.5 86,21.5 81.5,16.5 79.5,14.5 84,14.5 79.5,11.5 79.5,8.5 81.5,7.5 83,4 88.5,33.5 78,36.5 80,41 78.5,37.5 59.5,36.5 55,37.5 54,39 53.5,41 73,36 76.5,36.5 81.5,44 82.5,45.5 82,41 84,41 86,41 88,41 90,41 92,41 94,41 96,41 56,7.5 50,20.5 48.5,17.5 42,21 78.04,33.59 81.15,33.53 80.33,29.72 82.74,29.72 67.82,26.23 52.7,24.89 45.72,26.23 43.05,30.1 29.15,35.05 34.54,35.5 43.31,18.67 47.31,13.78 40.96,16.07 28.19,19.05 44.39,3.62 33.02,21.21 25.4,25.21 20.32,25.21 12.7,25.08 12.7,37.02 19.81,30.23 25.97,29.78 34.35,28.19 24.19,26.73 61.59,45.91 61.59,43.94 72.01,43.94 60.71,40.83 38.86,31.18 8.5,65 6.5,66.5 6,62 7,61 9.5,60 11.5,60 13,59.5 14,58 14.5,56.5 14.5,55 14.5,53.5 16.5,52.5 16.5,54 16.5,55.5 16.5,57 11.5,52.5 11.5,54 11.5,55.5 11.5,57 9.5,53.5 9.5,55 9.5,56.5 6.22,57.15 3.81,57.28 3.81,54.48 6.48,54.48 20.19,57.15 22.86,57.15 20.32,54.48 22.86,54.48 26,56.5 26,55 26,53.5 28,52.5 28,54 28,55.5 28,57 31,53.5 31,55 31,56.5 33,52.5 33,54 33,55.5 33,57 15,61 14,62 12.5,62 10.5,62 9,62.5 31,61 30,62 28.5,62 27,62 25.5,62.5 25,65 23,66.5 10,6 10,10 10,14 10,18 8,12 8,16 8,20 8,8 6,6 4,12 4,8 2,10 2,14 2,22 2,26 2,30 2,34 2,38 4,32 4,28 6,30 8,28 12,28 10,30 12,32 8,32 20,28 2,62 2,70 4,72 6,70 6,78 8,72 10,74 10,70 12,72 12,68 12,76 14,78 14,74 14,70 16,72 16,76 18,70 18,74 18,78 20,72 20,76 22,70 22,74 22,78 24,72 26,70 26,74 28,72 28,68 28,64 28,76 30,78 30,74 30,70 32,72 34,70 38,78 36,76 36,72 38,70 38,74 40,72 42,74 42,70 44,72 46,70 46,74 46,78 44,68 48,76 48,72 50,70 50,74 50,78 52,76 52,72 54,70 54,74 54,78 56,72 56,68 58,70 58,74 60,72 62,74 62,78 62,70 64,72 64,76 66,70 66,74 66,78 68,72 68,76 70,70 70,74 70,78 72,72 72,68 74,70 74,74 76,72 78,74 78,70 78,78 80,76 80,72 82,70 82,74 82,78 84,76 84,72 86,70 86,74 86,78 88,72 88,76 88,68 90,70 90,74 92,72 94,70 94,74 96,72 94,66 41.75,57.75 57.75,57.5 75.5,57.75 90.75,57.75 97.25,58.5 87.25,9.75 49.75,28.75 41.75,63.75 58.25,64 74.75,64.25 91,63.75 50.5,58.75 66.5,58.75 82.5,59.5 64,51.25 69,51.25 56.5,46.5 76.75,46.75 78.25,45.5 82.25,47.75 91.75,47.5 87.75,47.75 91.75,51.25 87.25,43.5 91.75,43.5 96.75,47.5 56.75,41.5 51,47.25 42,47.75 45.5,47.75 42,51.25 30.5,47.75 35.25,47.75 35.5,59.75 46.25,58.75 53.25,44 61.25,48.75 72,48.75 73.75,52.25 59.5,51.25 87.75,51.5 78,51.5 72,40.75 76.75,41.5 59.5,33 73.25,33.5 60.27,10.27 60.27,12.21 60.36,8.33 60.26,13.78 64.38,16.98 45.99,24.63 20.5,21 22.75,21 24.75,21 21.75,19.25 24,19.25 42.75,1.5 46.25,1.5 49.75,1.5 40,1.5 13.25,47.75 66.25,38.25 62,38.75 60.5,38.75 69,38.75 70.75,39.25 72.25,39.25 50,7.25
  pour Top (rank 2): -2.29,81.53 103.89,81.53 103.89,-2.16 -2.29,-2.16
  pour Bottom (rank 2): -3.43,82.3 107.19,82.3 107.19,-3.68 -3.56,-3.68 -3.56,82.3
IN_BCLK  (via drill 0.3)
  Top 0.2: U$1.9 61.23,22.88 60.07,21.72 60.07,16.38 58.8,15.11 v58.8,13.59
  Bottom 0.2: v58.8,13.59 58.8,6.48 58.42,6.1 58.42,4.19 JP2.5
IN_LRCLK  (via drill 0.3)
  Top 0.2: U$1.8 61.23,23.38 59.69,21.84 59.69,16.64 57.78,14.73 v57.78,14.48
  Bottom 0.2: v57.78,14.48 57.78,6.1 JP2.4
MCLK_IN  (via drill 0.3)
  Top 0.2: v78.61,23.62 78.61,4.06 JP2.19
  Bottom 0.2: JP1.3 v78.61,23.62
MP1  (via drill 0.3)
  Top 0.2: U$1.10 61.24,22.38 60.45,21.59 60.45,15.88 59.69,15.11 v59.69,14.48
  Bottom 0.2: v59.69,14.48 JP2.6
MP2
  Top 0.2: U$1.29 74.03,23.38 76.2,21.21 76.2,9.27 74.93,8 JP2.18
MP3
  Top 0.2: U$1.28 73.77,22.88 75.56,21.08 75.56,9.53 72.39,6.35 JP2.16
MP6
  Top 0.2: U$1.15 65.56,8.16 63.5,6.1 63.5,4.19 JP2.9
MP7
  Top 0.2: U$1.14 65.06,8.29 JP2.8
MP8
  Top 0.2: U$1.27 73.5,22.38 74.93,20.95 74.93,9.78 71.37,6.22 71.37,4.83 72.01,4.19 73.66,4.19 JP2.17
MP9
  Top 0.2: U$1.26 73.24,21.88 74.3,20.83 74.3,9.91 JP2.14
MP10
  Top 0.2: U$1.16 66.06,8.02 64.77,6.73 JP2.10
MP11
  Top 0.2: U$1.19 67.56,13.72 68.07,13.21 68.07,9.53 66.67,8.13 66.67,7.24 65.79,6.35 65.79,4.45 66.04,4.19 66.42,3.81 JP2.11
N$1
  Top 0.2: U$1.3 59.97,25.88 R2.2
N$2  (via drill 0.3)
  Top 0.2: U$1.17 66.56,21.32 v66.42,21.46 | v55.88,21.34 55.88,13.92 T1.1
  Top 0.5: R1.1 51.84,13.74 T1.1
  Bottom 0.2: v66.42,21.46 56.01,21.46 v55.88,21.34
N$3
  Top 0.2: C20.2 C19.2 79.12,29.59 78.74,29.21 74.93,29.21 74.42,28.7 74.42,27.3 73.5,26.38 U$1.35
N$4
  Top 0.2: IC3.14 71.25,49.66 | 71.25,49.66 73.03,51.44 C30.1 | IC3.13 69.98,48.39 71.25,49.66
  Bottom 0.2: C33.2 C23.1 C30.1
N$5
  Top 0.2: C20.1 84.07,33.15 84.45,33.53 R7.2
N$6
  Top 0.2: R6.2 87.88,23.88 Q1.2 89.79,21.97 C18.2
N$7
  Top 0.2: JP1.1 88.14,27.43 Q1.1 90.17,29.46 C17.2
N$8
  Top 0.2: U$1.31 74.81,24.38 R6.1
N$9
  Top 0.5: LED1.A 12.15,3.3 12.68,3.83 15.56,3.83 16.09,3.3 R8.1
N$10
  Top 0.2: U$1.32 80.51,24.88 81.15,25.53 JP1.2
N$11  (via drill 0.3)
  Top 0.2: JP3.15 R37.1 9.91,35.18 v19.05,35.18
  Bottom 0.2: v19.05,35.18 19.05,29.72 19.81,28.96 Q4.1
N$12
  Bottom 0.2: C21.2 C47.2 R12.1
N$13
  Top 0.2: R14.2 56.52,49.53 58.93,51.94 58.93,54.23 61.21,56.52 C29.1
  Bottom 0.2: R15.1 58.93,46.99 R14.2
N$14
  Top 0.2: JP3.14 R38.1 20.32,36.2 20.95,35.56 Q5.1
N$15
  Top 0.2: IC3.1 62.1,49.66 | 62.1,49.66 60.33,51.44 C26.1 | IC3.2 63.37,48.39 62.1,49.66
  Bottom 0.2: C26.1 C22.1 C29.2
N$16
  Top 0.2: IC3.3 61.34,47.12 R15.2
  Bottom 0.2: R15.2 61.34,51.94 62.23,51.94 62.87,52.58 C31.1
N$17
  Bottom 0.2: C25.1 48.26,51.56 49.4,50.42 R10.1 46.86,46.35 R9.2
N$18
  Top 0.2: IC3.6 62.1,43.31 | 62.1,43.31 55.37,43.31 52.58,46.1 52.58,48.64 51.82,49.4 50.93,49.4 49.78,50.55 48.01,50.55 C47.1 | IC3.7 63.37,42.04 62.1,43.31
  Bottom 0.2: C47.1 C21.1 C25.2
N$19
  Bottom 0.2: C22.2 C26.2 53.72,54.1 53.59,53.98 R16.1
N$20
  Top 0.2: IC3.5 55.75,44.58 53.85,46.48 53.85,49.28 52.83,50.29 51.44,50.29 50.04,51.69 49.15,51.69 C27.1
  Bottom 0.2: R10.2 45.34,48.9 46.99,50.55 C27.1
N$21
  Top 0.2: C33.1 72.14,56.52 74.55,54.1 74.55,51.82 R18.2
  Bottom 0.2: R19.1 74.42,47.12 R18.2
N$22
  Bottom 0.2: C23.2 C30.2 79.12,54.1 79.5,54.48 R20.1
N$23
  Top 0.2: JP3.16 R35.1 13.59,28.96 Q2.1
N$24
  Top 0.2: IC3.12 72.01,47.12 R19.2
  Bottom 0.2: R19.2 72.01,51.94 71.12,51.94 70.48,52.58 C35.1
N$25
  Top 0.2: R36.1 JP3.17
  Bottom 0.2: R36.1 5.97,34.04 Q3.1
N$26
  Bottom 0.2: C37.1 84.58,52.07 84.07,51.56 R23.1 86.61,46.35 R22.2
N$27
  Top 0.2: IC3.9 71.37,43.31 | 71.37,43.31 77.22,43.31 80.26,46.35 80.26,48.26 81.41,49.4 82.3,49.4 83.57,50.67 85.09,50.67 C38.1 | IC3.8 70.1,42.04 71.37,43.31
  Bottom 0.2: C38.1 C34.1 C37.2
N$28
  Top 0.2: IC3.10 76.07,44.58 78.99,47.5 78.99,49.02 80.64,50.67 81.92,50.67 83.31,52.07 83.95,52.07 C39.1
  Bottom 0.2: R23.2 88.9,48.9 85.85,51.94 C39.1
N$29
  Bottom 0.2: C34.2 C38.2 95.12,54.1 95.25,54.23 R24.1
N$30
  Top 0.2: JP8.5 JP8.3 JP8.1 C46.2 C48.2
N$31
  Top 0.2: C48.1 C46.1 15.62,58.55 13.21,60.96 8.89,60.96 R27.2 C42.1 3.94,63.5 5.59,65.15 7.01,65.15 X1.1
N$32
  Top 0.2: R26.1 JP8.2
N$33
  Top 0.2: R30.1 JP8.4
N$34
  Top 0.2: X2.1 23.21,65.02 21.59,65.02 20.32,63.75 C44.1 R29.2 25.4,60.96 29.46,60.96 C41.1 C43.1
N$35
  Top 0.2: R31.1 JP8.6
N$36
  Top 0.2: C43.2 C41.2 JP9.1 JP9.3 JP9.5
N$37
  Top 0.2: JP9.2 R28.1
N$38
  Top 0.2: JP9.4 R32.1
N$39
  Top 0.2: JP9.6 R33.1
N$40
  Top 0.2: R31.2 R30.2 R26.2 15.02,43.18 15.91,44.07 47.5,44.07 49.37,42.2 49.37,36.19 58.73,26.83 60.68,26.83 61.14,26.38 U$1.2
N$41
  Top 1: X3.1 2.67,17.06 D2.A
N$43
  Top 0.2: IC1.7 41.66,26.44 43.23,24.86 43.23,20.46 44.74,18.96 JP4.2
SCL  (via drill 0.3)
  Top 0.2: Q4.3 v30.35,28.96 37.72,28.96 39.12,27.56 IC1.6 40.64,25.78 40.64,19.68 43.18,17.14 SV2.1 | JP2.15 71.12,4.19 69.47,4.19 68.83,4.83 68.83,5.97 69.56,6.7 U$1.23 69.56,22.82 v69.6,22.86
  Bottom 0.2: R4.1 v30.35,28.96 | v69.6,22.86 49.02,22.86 43.18,17.02 SV2.1
SDA  (via drill 0.3)
  Top 0.2: R5.1 34.29,27.3 IC1.5 38.1,25.78 38.1,20.83 41.91,17.02 41.91,15.11 43.18,13.84 SV2.3 44.58,14.86 v47.75,14.86 | JP2.12 69.06,7.21 69.06,14.06 68.83,14.29 v68.83,15.37 68.83,17.02 69.06,17.24 U$1.22
  Bottom 0.2: R5.1 33.02,32.13 31.11,34.04 Q5.3 | v68.83,15.37 54.6,15.37 54.09,14.86 v47.75,14.86
SDATA_IN  (via drill 0.3)
  Top 0.2: U$1.11 61.38,21.88 60.83,21.34 v60.83,14.48
  Bottom 0.2: v60.83,14.48 60.83,8.89 63.5,6.22 63.5,4.19 JP2.7
V+
  Top 1: D2.C C49.+ D1.C D3.C 18.8,17.15 16.38,14.74 C51.2 13.74,13.59 13.74,8.83 14.88,7.69 U$2.OUT
VOUT0
  Top 0.2: U$1.46 65.56,37.06 65.15,37.47 56.64,37.47 54.86,39.24 54.86,40.89 R9.1
VOUT1
  Top 0.2: U$1.45 66.06,37.19 65.28,37.97 57.78,37.97 R14.1
VOUT2
  Top 0.2: U$1.44 66.56,37.22 67.31,37.97 69.72,37.97 70.1,38.35 75.82,38.35 R18.1
VOUT3
  Top 0.2: U$1.43 67.06,36.96 67.44,37.34 70.1,37.34 70.61,37.85 77.6,37.85 78.3,38.55 78.3,40.56 79.25,41.5 79.25,43.81 81.79,46.35 R22.1
WB
  Top 0.2: U$1.20 68.06,13.86 68.58,13.34 68.58,8.26 66.17,5.84 66.17,5.08 67.06,4.19 68.58,4.19 JP2.13
WP  (via drill 0.3)
  Top 0.2: R3.1 v17.27,26.04 | v27.56,29.72 41.87,29.72 42.94,28.64 42.94,26.32 43.89,25.38 48.46,25.38 50.3,23.54 50.3,22.56 51.36,21.5 JP4.1 | U$1.21 68.56,22.08 v68.58,22.1
  Bottom 0.2: v17.27,26.04 Q2.3 | R3.1 v27.56,29.72 | v68.58,22.1 68.33,22.35 55.38,22.35 54.52,21.5 JP4.1
(copper drawn outside any net)
  shapes: Top area x161

### Text on the board
Top: TOP | + | 1.1
Bottom: BOT
tNames: ADC0 | ADC1 | VOUT0 | VOUT1 | VOUT2 | VOUT3 | + | + | + | + | + | + | + | + | + | + | + | + | 1 | RST / WP / SCL / SDA | GND | 1 | 1 | +5V | 5-15V | + | www.freedsp.cc | - | + | 1